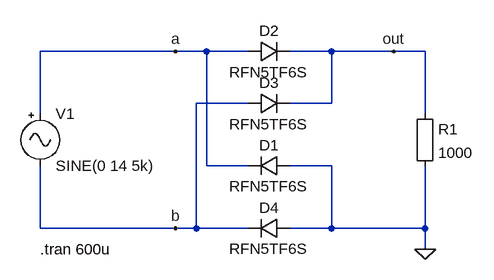
[diagram p0: schematic RB-6.asc]
RB-6.asc, the LTspice schematic file:
Version 4
SHEET 1 880 680
WIRE 64 -208 -144 -208
WIRE 112 -208 64 -208
WIRE 176 -208 112 -208
WIRE 304 -208 240 -208
WIRE 400 -208 304 -208
WIRE 448 -208 400 -208
WIRE 176 -128 96 -128
WIRE 304 -128 304 -208
WIRE 304 -128 240 -128
WIRE -144 -112 -144 -208
WIRE 448 -112 448 -208
WIRE 112 -32 112 -208
WIRE 176 -32 112 -32
WIRE 304 -32 240 -32
WIRE -144 64 -144 -32
WIRE 64 64 -144 64
WIRE 96 64 96 -128
WIRE 96 64 64 64
WIRE 176 64 96 64
WIRE 304 64 304 -32
WIRE 304 64 240 64
WIRE 448 64 448 -32
WIRE 448 64 304 64
WIRE 448 96 448 64
FLAG 448 96 0
FLAG 64 -208 a
FLAG 400 -208 out
FLAG 64 64 b
SYMBOL diode 240 -48 R90
WINDOW 0 0 32 VBottom 2
WINDOW 3 32 32 VTop 2
SYMATTR InstName D1
SYMATTR Value RFN5TF6S
SYMBOL Misc\\EuropeanResistor 432 -128 R0
SYMATTR InstName R1
SYMATTR Value 1000
SYMBOL Misc\\signal -144 -128 R0
WINDOW 123 0 0 Left 2
SYMATTR SpiceLine Rser=0.5
SYMATTR InstName V1
SYMATTR Value SINE(0 14 5k)
SYMBOL diode 176 -192 R270
WINDOW 0 32 32 VTop 2
WINDOW 3 0 32 VBottom 2
SYMATTR InstName D2
SYMATTR Value RFN5TF6S
SYMBOL diode 176 -112 R270
WINDOW 0 32 32 VTop 2
WINDOW 3 0 32 VBottom 2
SYMATTR InstName D3
SYMATTR Value RFN5TF6S
SYMBOL diode 240 48 R90
WINDOW 0 0 32 VBottom 2
WINDOW 3 32 32 VTop 2
SYMATTR InstName D4
SYMATTR Value RFN5TF6S
TEXT -144 96 Left 2 !.tran 600u

The netlist it stands for:
* RB-6.asc
D1 0 a RFN5TF6S
R1 out 0 1000
V1 a b SINE(0 14 5k) Rser=0.5
D2 a out RFN5TF6S
D3 b out RFN5TF6S
D4 0 b RFN5TF6S
.model D D
.lib standard.dio
.tran 600u
.backanno
.end